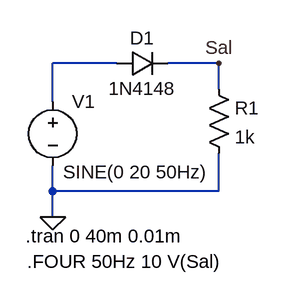
[diagram p0: schematic E1-Rectif-media-onda.asc]
E1-Rectif-media-onda.asc, the LTspice schematic file:
Version 4
SHEET 1 880 680
WIRE -304 -112 -384 -112
WIRE -176 -112 -240 -112
WIRE -176 -80 -176 -112
WIRE -384 -64 -384 -112
WIRE -384 48 -384 16
WIRE -176 48 -176 0
WIRE -176 48 -384 48
WIRE -384 80 -384 48
FLAG -384 80 0
FLAG -176 -112 Sal
SYMBOL diode -304 -128 M90
WINDOW 0 0 32 VBottom 2
WINDOW 3 32 32 VTop 2
SYMATTR InstName D1
SYMATTR Value 1N4148
SYMBOL res -192 -96 R0
SYMATTR InstName R1
SYMATTR Value 1k
SYMBOL voltage -384 -80 R0
WINDOW 3 13 104 Left 2
WINDOW 123 0 0 Left 0
WINDOW 39 0 0 Left 0
SYMATTR InstName V1
SYMATTR Value SINE(0 20 50Hz)
TEXT -418 104 Left 2 !.tran 0 40m 0.01m
TEXT -416 136 Left 2 !.FOUR 50Hz 10 V(Sal)

The netlist it stands for:
* E1-Rectif-media-onda.asc
D1 N001 Sal 1N4148
R1 Sal 0 1k
V1 N001 0 SINE(0 20 50Hz)
.model D D
.lib standard.dio
.tran 0 40m 0.01m
.FOUR 50Hz 10 V(Sal)
.backanno
.end